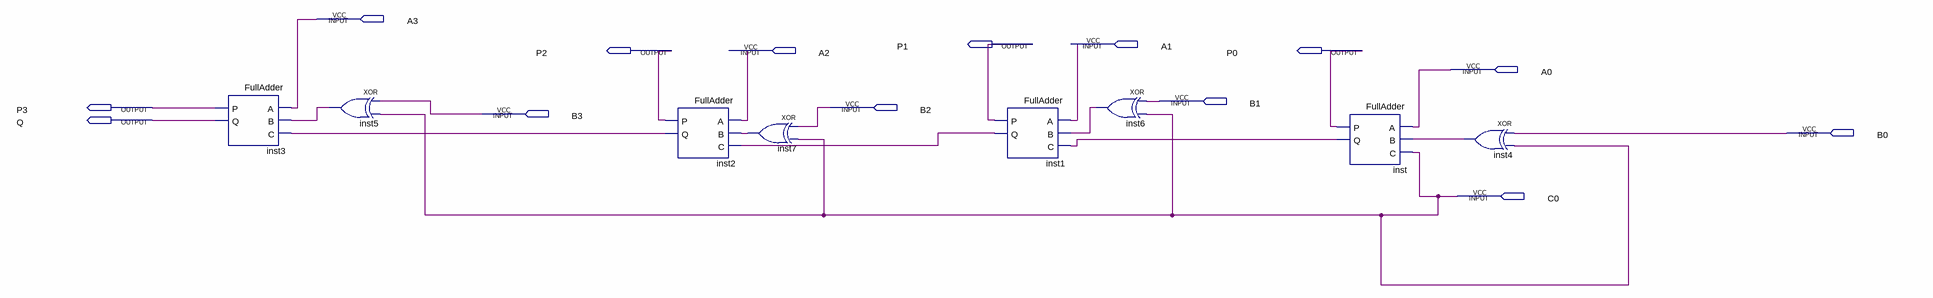
[diagram p0: schematic sheet]
// Quartus schematic Twos_Complement.bdf as structural Verilog: 8 symbols, 14 pins
module Twos_Complement (
  input  A3,
  input  A1,
  input  A2,
  input  A0,
  input  B1,
  input  B2,
  input  B3,
  input  B0,
  input  C0,
  output P1,
  output P2,
  output P0,
  output P3,
  output Q
);

  wire inst1_q, inst2_q, inst4_out, inst5_out, inst6_out, inst7_out, inst_q;

  FullAdder inst3 (.A(A3), .B(inst5_out), .C(inst2_q), .P(P3), .Q(Q));
  xor inst5 (inst5_out, B3, C0);
  FullAdder inst2 (.A(A2), .B(inst7_out), .C(inst1_q), .P(P2), .Q(inst2_q));
  xor inst7 (inst7_out, B2, C0);
  FullAdder inst1 (.A(A1), .B(inst6_out), .C(inst_q), .P(P1), .Q(inst1_q));
  xor inst6 (inst6_out, B1, C0);
  FullAdder inst (.A(A0), .B(inst4_out), .C(C0), .P(P0), .Q(inst_q));
  xor inst4 (inst4_out, B0, C0);
endmodule
